# EAGLE design smartcar_shield (EAGLE 7.5.0)
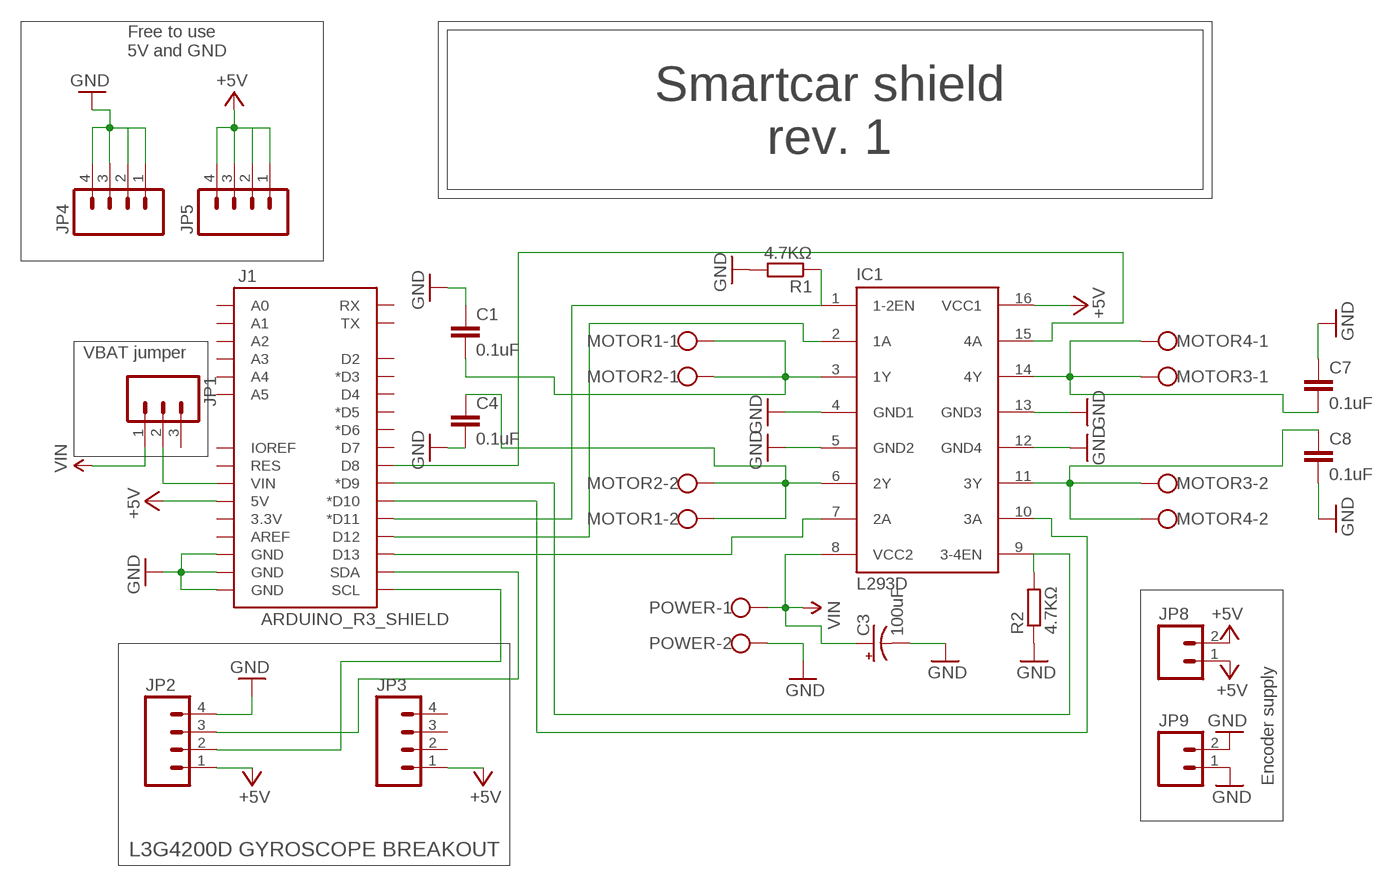
[diagram p0: schematic, sheet 1]

## Parts
C1  0.1uF  CAPKIT  [CAP-PTH-SMALL-KIT]
C3  100uF  CAP_POLPTH2  [CPOL-RADIAL-10UF-25V]
C4  0.1uF  CAPKIT  [CAP-PTH-SMALL-KIT]
C7  0.1uF  CAPKIT  [CAP-PTH-SMALL-KIT]
C8  0.1uF  CAPKIT  [CAP-PTH-SMALL-KIT]
IC1  L293D  [DIL16]
J1  ARDUINO_R3_SHIELD  [UNO_R3_SHIELD]
JP1  M03PTH  [1X03]
JP2  M04NO_SILK_ALL_ROUND  [1X04_NO_SILK_ALL_ROUND]
JP3  M04NO_SILK_ALL_ROUND  [1X04_NO_SILK_ALL_ROUND]
JP4  M04NO_SILK_ALL_ROUND  [1X04_NO_SILK_ALL_ROUND]
JP5  M04NO_SILK_ALL_ROUND  [1X04_NO_SILK_ALL_ROUND]
JP8  M021X02_NO_SILK  [1X02_NO_SILK]
JP9  M021X02_NO_SILK  [1X02_NO_SILK]
MOTOR1  W237-102  [W237-102]
MOTOR2  W237-102  [W237-102]
MOTOR3  W237-102  [W237-102]
MOTOR4  W237-102  [W237-102]
POWER  W237-102  [W237-102]
R1  4.7KΩ  R-EU_0207/10  [0207/10]
R2  4.7KΩ  R-EU_0207/10  [0207/10]

## Nets
12V: C3.1(+) IC1.8(VCC2) JP1.1 POWER.1 ; supply symbol labelled VIN
+5V: IC1.16(VCC1) J1.5V JP2.1 JP3.1 JP5.1 JP5.2 JP5.3 JP5.4 JP8.1 JP8.2
ENABLE1: IC1.1(1-2EN) J1.D11(*D11) R1.1
ENABLE2: IC1.9(3-4EN) J1.D9(*D9) R2.2
GND: C1.1 C3.2(-) C4.2 C7.1 C8.2 IC1.4(GND1) IC1.5(GND2) IC1.12(GND4) IC1.13(GND3) J1.GND@0(GND) J1.GND@1(GND) J1.GND@2(GND) JP2.4 JP4.1 JP4.2 JP4.3 JP4.4 JP9.1 JP9.2 POWER.2 R1.2 R2.1
MOTORA-1: IC1.2(1A) J1.D12
MOTORA-2: IC1.7(2A) J1.D13
MOTORA-OUT1: C1.2 IC1.3(1Y) MOTOR1.1 MOTOR2.1
MOTORA-OUT2: C4.1 IC1.6(2Y) MOTOR1.2 MOTOR2.2
MOTORB-1: IC1.15(4A) J1.D8
MOTORB-2: IC1.10(3A) J1.D10(*D10)
MOTORB-OUT1: C7.2 IC1.14(4Y) MOTOR3.1 MOTOR4.1
MOTORB-OUT2: C8.1 IC1.11(3Y) MOTOR3.2 MOTOR4.2
N$2: J1.SDA JP2.3
SCL: J1.SCL JP2.2
VIN: J1.VIN JP1.2
Unconnected: J1.3.3V J1.A0 J1.A1 J1.A2 J1.A3 J1.A4 J1.A5 J1.AREF J1.D2 J1.D3(*D3) J1.D4 J1.D5(*D5) J1.D6(*D6) J1.D7 J1.IOREF J1.RES J1.RX J1.TX JP1.3 JP3.2 JP3.3 JP3.4

## Notes on the sheet
- Free to use
  5V and GND
- Smartcar shield
  rev. 1
- VBAT jumper
- Encoder supply
- L3G4200D GYROSCOPE BREAKOUT

## Library data of the parts
C1 C4 C7 C8 = SparkFun-Capacitors:CAP: Capacitor Standard 0603 ceramic capacitor, and 0.1" leaded capacitor.
C3 = SparkFun-Capacitors:CAP_POL: Capacitor Polarized These are standard SMD and PTH capacitors. Normally 10uF, 47uF, and 100uF in electrolytic and tantalum varieties. Always verify the external diameter of the through hole cap, it varies with capacity, voltage, and manufacturer. The EIA devices should be standard.
IC1 = st-microelectronics:L293D: PUSH-PULL 4 CHANNEL DRIVER; MPN: L293D; OC_FARNELL: 9589619; OC_NEWARK: 56P8249
J1 = SparkFun-Boards:ARDUINO_R3_SHIELD: Shield form compatible with the Arduino Uno R3.
JP1 = SparkFun-Connectors:M03: Header 3 Standard 3-pin 0.1" header. Use with straight break away headers (SKU : PRT-00116), right angle break away headers (PRT-00553), swiss pins (PRT-00743), machine pins (PRT-00117), and female headers (PRT-00115). Molex polarized connector foot print use with SKU : PRT-08232 with associated crimp pins and housings.
JP2-JP5 = SparkFun-Connectors:M04: Header 4 Standard 4-pin 0.1" header. Use with straight break away headers (SKU : PRT-00116), right angle break away headers (PRT-00553), swiss pins (PRT-00743), machine pins (PRT-00117), and female headers (PRT-00115). Molex polarized connector foot print use with SKU : PRT-08231 with associated crimp pins and housings. 1MM SMD Version SKU: PRT-10208
JP8 JP9 = SparkFun-Connectors:M02: Standard 2-pin 0.1" header. Use with - straight break away headers ( PRT-00116) - right angle break away headers (PRT-00553) - swiss pins (PRT-00743) - machine pins (PRT-00117) - female headers (PRT-00115) Molex polarized connector foot print use with: PRT-08233 with associated crimp pins and housings. 2.54_SCREWTERM for use with PRT-10571. 3.5mm Screw Terminal footprints for PRT-08084 5mm Screw Terminal footprints for use with PRT-08432
MOTOR1-MOTOR4 POWER = con-wago-500:W237-102: WAGO SCREW CLAMP; MPN: 237-102; OC_FARNELL: unknown; OC_NEWARK: 70K9898
R1 R2 = rcl:R-EU_: RESISTOR, European symbol

## Net classes
0 default: width 0.152 mm, drill 0.305 mm, clearance 0.152 mm

## Board
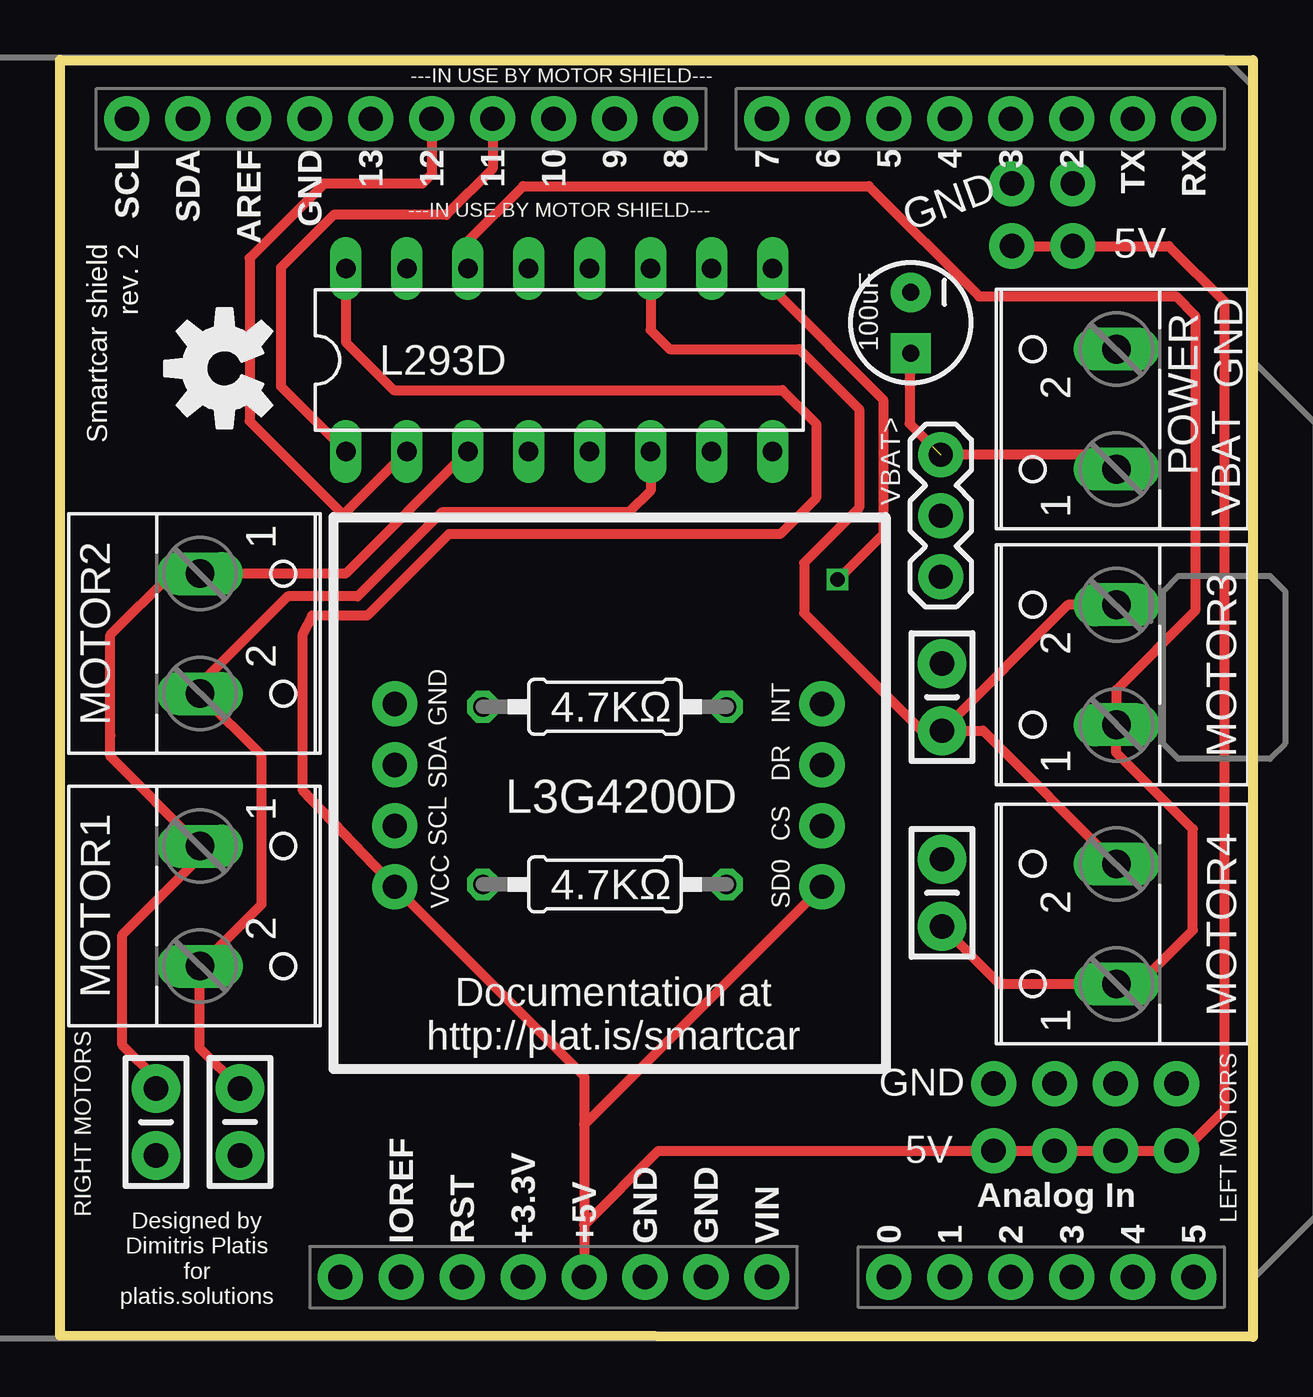
[diagram p1: board, top side]
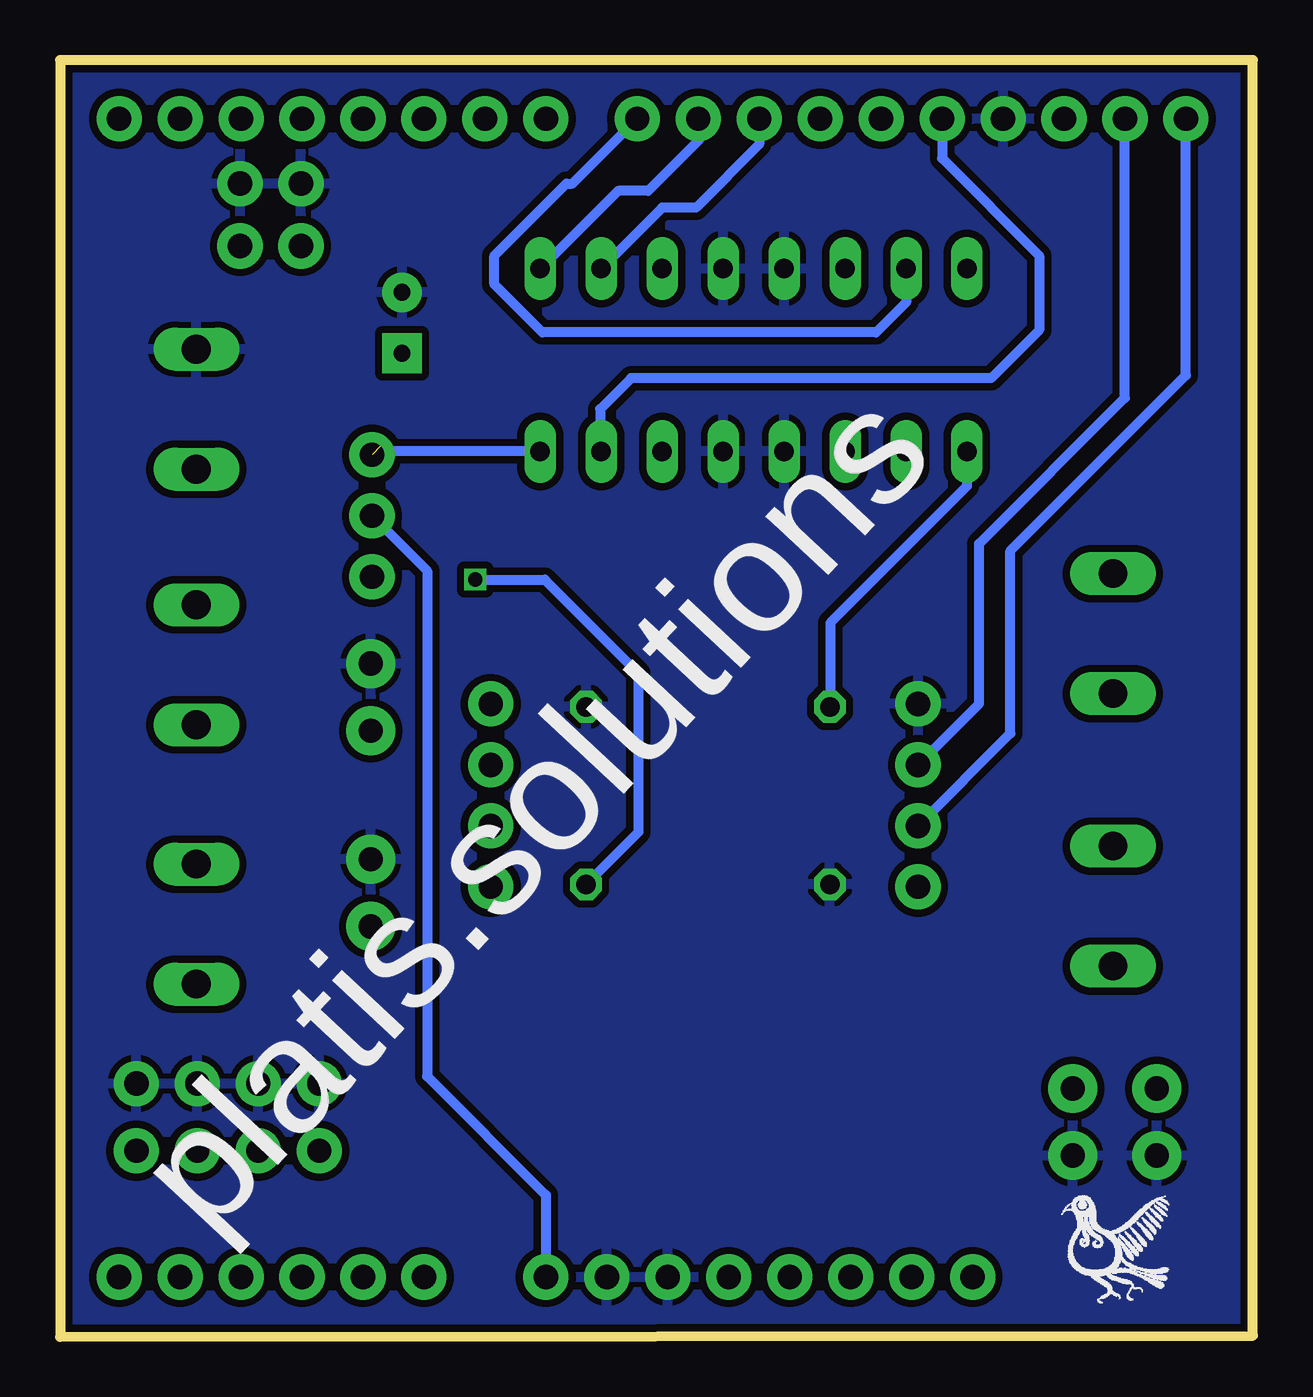
[diagram p2: board, bottom side, seen from below]

Size 49.7 x 53.2 mm. Coordinates in mm from the lower left corner, seen from the top.
Outline: 0,53.2 49.7,53.2 49.7,0 0,0.05 0,53.2
Copper layers (1*16): Top 0.035mm / dielectric 1.5mm / Bottom 0.035mm
Design rules "SeeedStudio_2layer_DRU_no_angle_20140221": minimum track width 6mil, minimum drill 12mil, track to track 6mil, track to pad 6mil, pad to pad 6mil, via to via 6mil, smd to smd 0mil, copper to edge 10mil, drill to drill 10mil, minimum pad ring 10mil, minimum via ring 6mil, stop-mask expansion 2mil, vias tented up to drill 100mil, thermal gap 10mil

### Footprints (pad centres in the part's own frame; a part is rotated, then mirrored left to right if it is on the bottom)
CAP-PTH-SMALL-KIT = drill 1.016 pad 2.032: 1 -1.397,0; 2 1.397,0
CPOL-RADIAL-10UF-25V = drill 0.7 pad 1.651 square: 1 1.27,0 | drill 0.7 pad 1.651: 2 -1.27,0
DIL16 = drill 0.813 long: 1 -8.89,-3.81; 2 -6.35,-3.81; 3 -3.81,-3.81; 4 -1.27,-3.81; 5 1.27,-3.81; 6 3.81,-3.81; 7 6.35,-3.81; 8 8.89,-3.81; 9 8.89,3.81; 10 6.35,3.81; 11 3.81,3.81; 12 1.27,3.81; 13 -1.27,3.81; 14 -3.81,3.81; 15 -6.35,3.81; 16 -8.89,3.81
UNO_R3_SHIELD = drill 1.016 pad 1.88: 3.3V 50.8,26.67; 5V 50.8,29.21; A0 50.8,41.91; A1 50.8,44.45; A2 50.8,46.99; A3 50.8,49.53; A4 50.8,52.07; A5 50.8,54.61; AREF 2.54,15.24; D2 2.54,49.53; D3 2.54,46.99; D4 2.54,44.45; D5 2.54,41.91; D6 2.54,39.37; D7 2.54,36.83; D8 2.54,33.02; D9 2.54,30.48; D10 2.54,27.94; D11 2.54,25.4; D12 2.54,22.86; D13 2.54,20.32; GND@0 50.8,31.75; GND@1 50.8,34.29; GND@2 2.54,17.78; IOREF 50.8,21.59; NC 50.8,19.05; RES 50.8,24.13; RX 2.54,54.61; SCL 2.54,10.16; SDA 2.54,12.7; TX 2.54,52.07; VIN 50.8,36.83
1X03 = drill 1.016 pad 1.88: 1 0,0; 2 2.54,0; 3 5.08,0
1X04_NO_SILK_ALL_ROUND = drill 1.016 pad 1.88: 1 0,0; 2 2.54,0; 3 5.08,0; 4 7.62,0
1X02_NO_SILK = drill 1.016 pad 1.88: 1 0,0; 2 2.54,0
W237-102 = drill 1.194 long: 1 -2.5,-1.27; 2 2.5,-1.27
0207/10 = drill 0.813 octagon: 1 -5.08,0; 2 5.08,0

### Placement (x,y rotation side)
C1  4,8.95 90 top
C3  35.45,42.25 270 top
C4  7.5,8.95 270 top
C7  36.75,18.5 270 top
C8  36.75,26.65 90 top
IC1  20.8,40.7 0 top
J1  -7.37,53.29 270 top
JP1  36.7,36.75 270 top
JP2  13.95,18.75 90 top
JP3  31.75,18.75 90 top
JP4  38.9,10.55 0 top
JP5  38.9,7.75 0 top
JP8  42.2,45.45 180 top
JP9  42.2,48.05 180 top
MOTOR1  7.1,17.95 270 top
MOTOR2  7.1,29.3 270 top
MOTOR3  42.75,28 90 top
MOTOR4  42.75,17.2 90 top
POWER  42.75,38.65 90 top
R1  22.7,26.25 0 top
R2  22.7,18.85 0 top
U$1  [OSHW-LOGO-M]  6.85,40.35 90 top

### Tracks (layer width: path | path; a pad name or v marks a point on that pad's centre or on a via)
12V  (1 unrouted)
  Top 0.406: C3.1 35.4,40.93 35.4,38.05 JP1.1 43.42,36.75 POWER.1
  Bottom 0.406: IC1.8 36.14,36.89 36.35,37.1
+5V
  Top 0.406: 21.84,8.84 21.84,10.86 JP2.1 10.1,22.8 10.1,29.25 10.5,30.05 12.8,30.05 16.2,33.45 30,33.45 31.5,34.95 31.5,38.05 30.1,39.45 13.9,39.45 11.91,41.44 IC1.16 | JP3.1 21.84,8.84 | 21.84,8.84 J1.5V 21.84,4.65 24.94,7.75 JP5.1 JP5.2 JP5.3 JP5.4 46.82,7.75 48.5,9.43 48.5,43.15 46.2,45.45 JP8.1 JP8.2
ENABLE1
  Top 0.406: J1.D11 18.03,48.68 16.1,46.75 11.4,46.75 9.2,44.55 9.2,39.6 IC1.1
  Bottom 0.406: IC1.1 11.91,35.44 17.6,29.75 17.6,26.27 R1.1
ENABLE2  (via drill 0.6)
  Top 0.406: IC1.9 29.69,43.66 34.3,39.05 34.3,33.45 v32.4,31.55
  Bottom 0.406: J1.D9 23.11,49.84 25.2,47.75 26.45,47.75 IC1.9 | v32.4,31.55 29.5,31.55 25.6,27.65 25.6,21.03 R2.2
GND
  pour Bottom (isolate 0.305): 0.35,53.1 49.5,53.1 49.5,0.2 0.4,0.2
MOTORA-1
  Top 0.406: J1.D12 15.49,48.44 15.1,48.05 11,48.05 7.9,44.95 7.9,38.15 11.8,34.25 11.81,34.25 IC1.2
MOTORA-2
  Bottom 0.406: J1.D13 12.95,49.1 8.9,45.05 8.9,41.95 10.9,39.95 25.9,39.95 27.2,38.65 27.2,36.94 IC1.7
MOTORA-OUT1
  Top 0.406: IC1.3 11.9,31.8 MOTOR2.1 4.65,31.8 2.1,29.25 2.1,25.05 2.1,24.18 MOTOR1.1 5.83,19.98 2.6,16.75 2.6,12.15 4,10.75 C1.2
MOTORA-OUT2
  Top 0.406: IC1.6 24.61,35.26 23.7,34.35 15.9,34.35 12.4,30.85 9.48,30.85 5.83,27.2 MOTOR2.2 8.4,24.23 8.4,18.02 MOTOR1.2 5.83,12.02 C4.1
MOTORB-1
  Bottom 0.406: IC1.15 14.45,43.1 15.7,41.85 29.6,41.85 31.6,43.85 31.6,45.05 28.6,48.05 28.35,48.05 J1.D8
MOTORB-2
  Bottom 0.406: J1.D10 20.57,49.68 23.2,47.05 24.61,47.05 IC1.10
MOTORB-OUT1
  Top 0.406: IC1.14 16.99,45.64 19.3,47.95 33.7,47.95 38.3,43.35 46.5,43.35 47.3,42.55 47.3,30.25 44,26.95 44,25.52 MOTOR3.1 44.02,24.33 47.2,21.15 47.2,16.95 44.95,14.7 MOTOR4.1 39.15,14.7 C7.2
MOTORB-OUT2
  Top 0.406: IC1.11 24.61,41.94 25.4,41.15 30.8,41.15 33.3,38.65 33.3,34.55 31,32.25 31,30.15 35.9,25.25 C8.1 | C8.1 42,30.5 MOTOR3.2 | C8.1 38.47,25.25 MOTOR4.2
N$2
  Bottom 0.406: JP2.3 11.4,26.38 11.4,33.05 5.33,39.12 J1.SDA
SCL
  Bottom 0.406: JP2.2 10.1,25.14 10.1,32.75 2.79,40.06 J1.SCL
VIN
  Bottom 0.406: JP1.2 34.4,31.91 34.4,10.85 29.46,5.91 J1.VIN

### Text on the board
tPlace: ---IN USE BY MOTOR SHIELD--- | ---IN USE BY MOTOR SHIELD--- | Smartcar shield / rev. 2 | GND | 5V | GND | VBAT> | VBAT | GND | INT | SDA | L3G4200D | DR | CS | SCL | VCC | SD0 | RIGHT MOTORS | Documentation at / http://plat.is/smartcar | GND | 5V | LEFT MOTORS | Designed by / Dimitris Platis / for / platis.solutions
bPlace: platis.solutions